# Altium schematic sheet Rail_4.SchDoc: Half Bridge 4
size A4; DocumentNumber: 6; Revision: 1.1; SheetNumber: 6; SheetTotal: 6
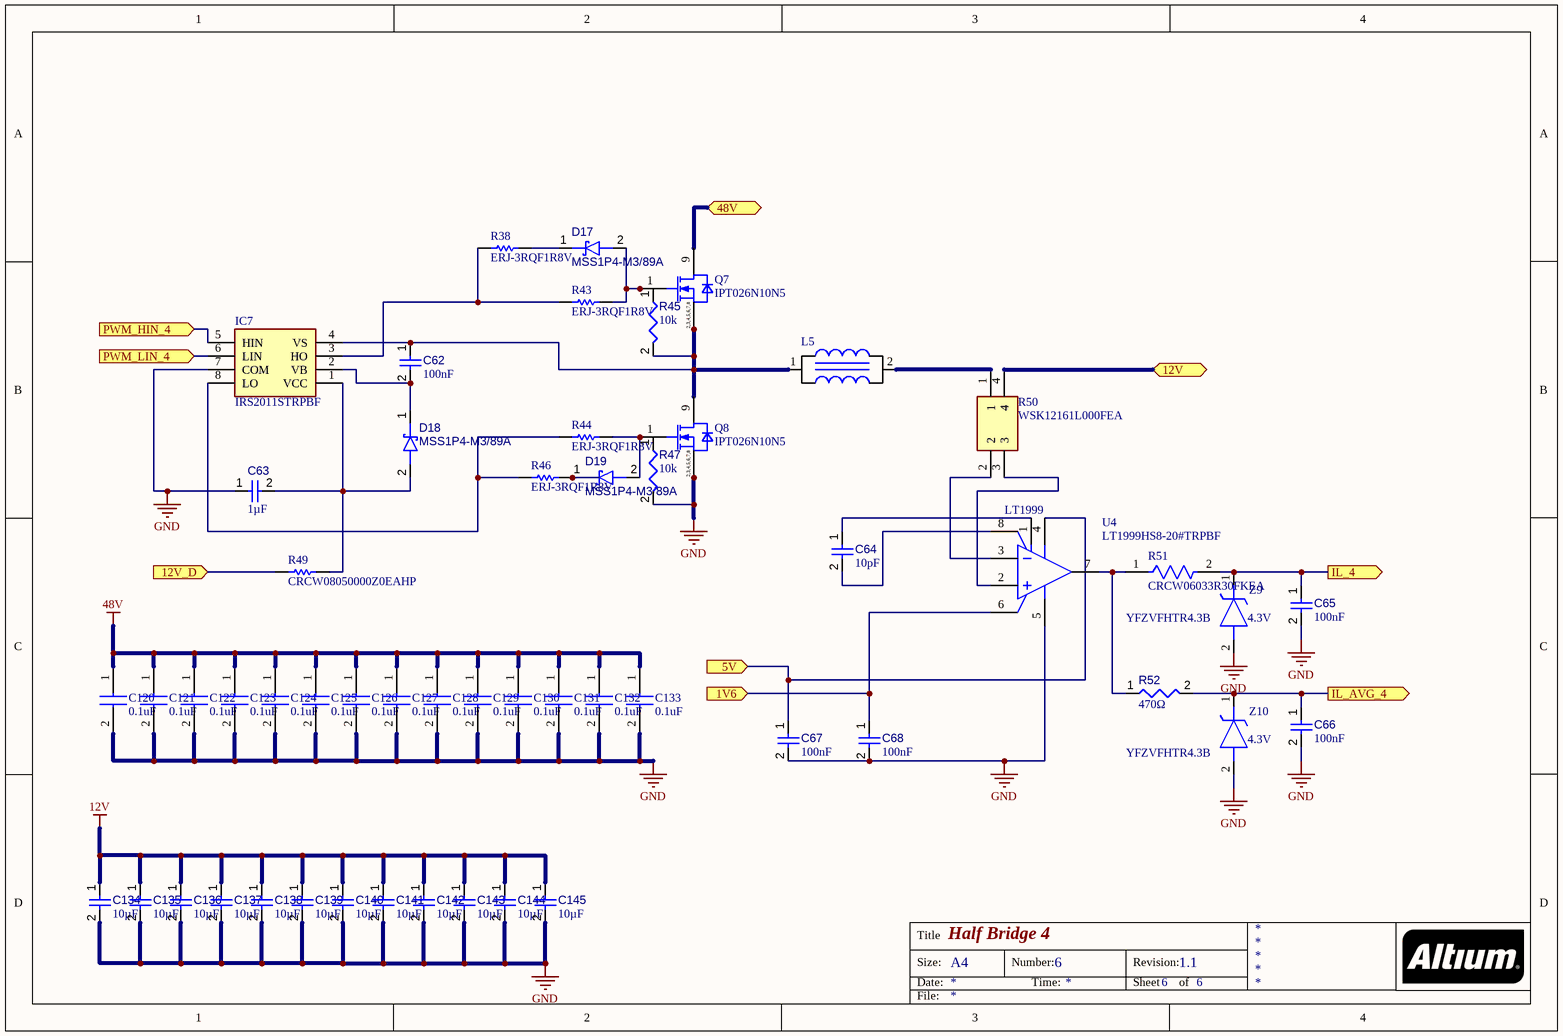
[diagram p0: Rail_4.SchDoc]

## Parts
C62  value 100nF  [CAPC1608X90X40ML10T20]  (hidden comment: Capacitor 100 nF +/-10% 50 V 0603)
C63  value 1µF  [CAPC0603(1608)100_L]  (hidden comment: Capacitor 1µF +/-0.1% 25V 0603)
C64  value 10pF  [CAPC1608X87X35ML15T15]  (hidden comment: Capacitor 10 pF +/- 0.25 pF 50 V 0603)
C65  value 100nF  [CAPC1608X90X40ML10T20]  (hidden comment: Capacitor 100 nF +/-10% 50 V 0603)
C66  value 100nF  [CAPC1608X90X40ML10T20]  (hidden comment: Capacitor 100 nF +/-10% 50 V 0603)
C67  value 100nF  [CAPC1608X90X40ML10T20]  (hidden comment: Capacitor 100 nF +/-10% 50 V 0603)
C68  value 100nF  [CAPC1608X90X40ML10T20]  (hidden comment: Capacitor 100 nF +/-10% 50 V 0603)
C120  0.1uF  [CAPC1608X90N]
C121  0.1uF  [CAPC1608X90N]
C122  0.1uF  [CAPC1608X90N]
C123  0.1uF  [CAPC1608X90N]
C124  0.1uF  [CAPC1608X90N]
C125  0.1uF  [CAPC1608X90N]
C126  0.1uF  [CAPC1608X90N]
C127  0.1uF  [CAPC1608X90N]
C128  0.1uF  [CAPC1608X90N]
C129  0.1uF  [CAPC1608X90N]
C130  0.1uF  [CAPC1608X90N]
C131  0.1uF  [CAPC1608X90N]
C132  0.1uF  [CAPC1608X90N]
C133  0.1uF  [CAPC1608X90N]
C134  value 10µF  [CAPC0805(2012)145_L]  (hidden comment: Capacitor 10µF +/-20% 25V 0805)
C135  value 10µF  [CAPC0805(2012)145_L]  (hidden comment: Capacitor 10µF +/-20% 25V 0805)
C136  value 10µF  [CAPC0805(2012)145_L]  (hidden comment: Capacitor 10µF +/-20% 25V 0805)
C137  value 10µF  [CAPC0805(2012)145_L]  (hidden comment: Capacitor 10µF +/-20% 25V 0805)
C138  value 10µF  [CAPC0805(2012)145_L]  (hidden comment: Capacitor 10µF +/-20% 25V 0805)
C139  value 10µF  [CAPC0805(2012)145_L]  (hidden comment: Capacitor 10µF +/-20% 25V 0805)
C140  value 10µF  [CAPC0805(2012)145_L]  (hidden comment: Capacitor 10µF +/-20% 25V 0805)
C141  value 10µF  [CAPC0805(2012)145_L]  (hidden comment: Capacitor 10µF +/-20% 25V 0805)
C142  value 10µF  [CAPC0805(2012)145_L]  (hidden comment: Capacitor 10µF +/-20% 25V 0805)
C143  value 10µF  [CAPC0805(2012)145_L]  (hidden comment: Capacitor 10µF +/-20% 25V 0805)
C144  value 10µF  [CAPC0805(2012)145_L]  (hidden comment: Capacitor 10µF +/-20% 25V 0805)
C145  value 10µF  [CAPC0805(2012)145_L]  (hidden comment: Capacitor 10µF +/-20% 25V 0805)
D17  MSS1P4-M3/89A  [MicroSMP (DO-219AD)]
D18  MSS1P4-M3/89A  [MicroSMP (DO-219AD)]
D19  MSS1P4-M3/89A  [MicroSMP (DO-219AD)]
IC7  IRS2011STRPBF  [SOIC127P600X175-8N-12-V]
L5  Inductor (Ansys)  [Inductor-Footprint-1]  (value not drawn)
Q7  IPT026N10N5  [INF-PG-HSOF-8-1-0-V]
Q8  IPT026N10N5  [INF-PG-HSOF-8-1-0-V]
R38  ERJ-3RQF1R8V  [RESC1608X55X30LL15T15]
R43  ERJ-3RQF1R8V  [RESC1608X55X30LL15T15]
R44  ERJ-3RQF1R8V  [RESC1608X55X30LL15T15]
R45  value 10k  [RESC1608X55X25ML10T15]  (hidden comment: Resistor 10k +/-1% 0603 100 mW)
R46  ERJ-3RQF1R8V  [RESC1608X55X30LL15T15]
R47  value 10k  [RESC1608X55X25ML10T15]  (hidden comment: Resistor 10k +/-1% 0603 100 mW)
R49  CRCW08050000Z0EAHP  [RESC2013X50X30ML20T20]
R50  WSK12161L000FEA  [WSK12161L000FEA]
R51  CRCW06033R30FKEA  [FP-CRCW0603-e3-IPC_C]
R52  value 470Ω  [RESC0805(2012)_L]  (hidden comment: 470R5J)
U4  LT1999HS8-20#TRPBF  [LT-S8-8_L]
Z9  YFZVFHTR4.3B  [YFZVFHTR43B]
Z10  YFZVFHTR4.3B  [YFZVFHTR43B]

## Ports
1V6 (in), 5V (in), 12V (bidir), 12V_D (in), 48V (bidir), IL_4 (out), IL_AVG_4 (out), PWM_HIN_4 (in), PWM_LIN_4 (in)

## Nets
12V: C134.1 C135.1 C136.1 C137.1 C138.1 C139.1 C140.1 C141.1 C142.1 C143.1 C144.1 C145.1
48V: C120.1 C121.1 C122.1 C123.1 C124.1 C125.1 C126.1 C127.1 C128.1 C129.1 C130.1 C131.1 C132.1 C133.1
GND: C63.1 C65.2 C66.2 C67.2 C68.2 C120.2 C121.2 C122.2 C123.2 C124.2 C125.2 C126.2 C127.2 C128.2 C129.2 C130.2 C131.2 C132.2 C133.2 C134.2 C135.2 C136.2 C137.2 C138.2 C139.2 C140.2 C141.2 C142.2 C143.2 C144.2 C145.2 IC7.7(COM) Q8.2(SOURCE) Q8.3(SOURCE) Q8.4(SOURCE) Q8.5(SOURCE) Q8.6(SOURCE) Q8.7(SOURCE) Q8.8(SOURCE) R47.2 U4.5(GND) Z9.2(A) Z10.2(A)
1V6: C68.1 U4.6(REF) ; port 1V6
5V: C67.1 U4.4(V+) ; port 5V
12V: R50.4 ; port 12V  [a separate net that carries the same name]
12V_D: R49.1 ; port 12V_D
48V: Q7.9(DRAIN) ; port 48V  [a separate net that carries the same name]
IL_4: C65.1 R51.2 Z9.1(K) ; port IL_4
IL_AVG_4: C66.1 R52.2 Z10.1(K) ; port IL_AVG_4
PWM_HIN_4: IC7.5(HIN) ; port PWM_HIN_4
PWM_LIN_4: IC7.6(LIN) ; port PWM_LIN_4
NetC62_1: C62.1 IC7.4(VS) L5.1 Q7.2(SOURCE) Q7.3(SOURCE) Q7.4(SOURCE) Q7.5(SOURCE) Q7.6(SOURCE) Q7.7(SOURCE) Q7.8(SOURCE) Q8.9(DRAIN) R45.2
NetC62_2: C62.2 D18.1(K) IC7.2(VB)
NetC63_2: C63.2 D18.2(A) IC7.1(VCC) R49.2
NetC64_1: C64.1 U4.1(V+)
NetC64_2: C64.2 U4.8(~{SHDN})
NetD17_1: D17.1(K) R38.2
NetD17_2: D17.2(A) Q7.1(GATE) R43.2 R45.1
NetD19_1: D19.1(K) R46.2
NetD19_2: D19.2(A) Q8.1(GATE) R44.2 R47.1
NetIC7_3: IC7.3(HO) R38.1 R43.1
NetIC7_8: IC7.8(LO) R44.1 R46.1
NetL5_2: L5.2 R50.1
NetR50_2: R50.2 U4.3(-IN)
NetR50_3: R50.3 U4.2(+IN)
NetR51_1: R51.1 R52.1 U4.7(OUT)

## Notes on the sheet
- (near U4) LT1999
- (near Z9) 4.3V
- (near Z10) 4.3V
- Title
- Size:
- Date:
- A4
- Number:
- Time:
- Revision:
- Sheet
- of
- File:
- (in symbol IPT026N10N5) 2,3,4,5,6,7,8

## Library data of the parts
C62 C65-C68 = CMP-001-00017-4: Chip Capacitor, 100 nF, +/- 10%, 50 V, 0603 (1608 Metric); Capacitor Type: Ceramic; Voltage Rating: 50V; RoHS Compliant: True; Max Operating Temperature: 125°C; Pins: 2; Mounting Technology: SM; Min Operating Temperature: -55°C; Tolerance: 10%; Case/Package: 0603
C63 = CMP-001-00055-2: Chip Capacitor, 1µF +/-0.1%, 25V, 0603, Thickness 1 mm; Tolerance: 20%; Max Operating Temperature: 85°C; Voltage Rating: 25V; Min Operating Temperature: -55°C; Case/Package: 0805; Mounting Technology: SMT; Pins: 2
C64 = CMP-001-00012-4: Chip Capacitor, 10 pF, +/- 0.25 pF, 50 V, 0603 (1608 Metric); Tolerance: 0.25%; Capacitor Type: Ceramic; Voltage Rating: 50V; Min Operating Temperature: -55°C; Mounting Technology: SM; RoHS Compliant: True; Case/Package: 0603; Pins: 2; Max Operating Temperature: 125°C
C120-C133 = 06031C104K4T2A: Capacitor; Manufacturer_Name: AVX; Datasheet Link: https://componentsearchengine.com/Datasheets/1/06031A100FAT2A.pdf; Height: 0.9mm; Manufacturer_Part_Number: 06031C104K4T2A; Mouser Part Number: 581-06031C104K4T2A; Mouser Price/Stock: https://www.mouser.co.uk/ProductDetail/AVX/06031C104K4T2A?qs=7MVldsJ5UaycASOsZ6%2FbJQ%3D%3D
C134-C145 = CMP-001-00079-2: Chip Capacitor, 10µF +/-20%, 25V, 0805, Thickness 1.45 mm; Tolerance: 10%; Pins: 2; Max Operating Temperature: 85°C; Mounting Technology: SMT; Case/Package: 0603; Voltage Rating: 25V; Min Operating Temperature: -55°C
D17-D19 = CMP-004-00024-2: Schottky Diodes & Rectifiers 1.0 Amp 40 Volt; Max Surge Current: 25A; Forward Voltage: 460mV; Pins: 2; Min Operating Temperature: -55°C; Max Operating Temperature: 150°C; Mounting Technology: SMT
IC7 = IRS2011STRPBF: Integrated Circuit; Manufacturer_Name: Infineon; Datasheet Link: https://componentsearchengine.com/Datasheets/1/IRS2011STRPBF.pdf; Height: 1.75mm; Manufacturer_Part_Number: IRS2011STRPBF; Arrow Part Number: IRS2011STRPBF; Arrow Price/Stock: https://www.arrow.com/en/products/irs2011strpbf/infineon-technologies-ag; Mouser Part Number: 942-IRS2011STRPBF; Mouser Price/Stock: https://www.mouser.co.uk/ProductDetail/Infineon-IR/IRS2011STRPBF?qs=9%252BKlkBgLFf3Y4ge8A0TwYQ%3D%3D
L5 = CMP-006-00021-3: Ansys 3D Model
Q7 Q8 = IPT026N10N5: Insulated-Gate Field-Effect Transistor (IGFET), N-Channel, Enhancement, Body Diode, Pin 1 Gate, 2-8 Source, 9 Drain, 9 Pins; Manufacturer: Infineon Technologies; PackageReference: PG-HSOF-8-1; ManufacturerPartNumber: IPT026N10N5
R38 R43 R44 R46 = CMP-2000-00844-1: Manufacturer: Panasonic; Part Number: ERJ-3RQF1R8V
R45 R47 = CMP-009-00017-4: Chip Resistor, 10 KOhm, +/- 1%, 01 W, -55 to 155 degC, 0603 (1608 Metric); Voltage Rating: 50V; Power: 100mW; Min Operating Temperature: -55°C; Tolerance: 1%; Case/Package: 0603; Pins: 2; Max Operating Temperature: 155°C; RoHS Compliant: True; Mounting Technology: SM
R49 = CMP-2001-04185-1: Manufacturer: Vishay Dale; Part Number: CRCW08050000Z0EAHP
R50 = WSK12161L000FEA: Resistor; Manufacturer_Name: Vishay; Datasheet Link: http://www.vishay.com/docs/30189/wsk1216.pdf; Height: 1.9mm; Manufacturer_Part_Number: WSK12161L000FEA; Arrow Part Number: WSK12161L000FEA; Arrow Price/Stock: https://www.arrow.com/en/products/wsk12161l000fea/vishay; Mouser Part Number: 71-WSK12161L000FEA; Mouser Price/Stock: https://www.mouser.co.uk/ProductDetail/Vishay-Dale/WSK12161L000FEA?qs=jj7GbYRQuOayzWPPW7c8og%3D%3D
R51 = CMP-1012-00228-3: RES Thick Film, 3.3Ω, 1%, 0.1W, 100ppm/°C, 0603; Resistance: 3.3R; Max Power Dissipation: 100mW; Voltage Rating: 75V; Case Code (Imperial): 0603; Width: 0.85mm; Number of Terminations: 2; REACH SVHC: No SVHC; Case/Package: 0603; Package Quantity: 10; Radiation Hardening: No; Min Operating Temperature: -55°C; Max Operating Temperature: 155°C; Composition: Thick Film; Termination: SMD/SMT; Tolerance: 1%; Military Standard: Not; Weight: 7.1E-05oz; Contact Plating: Tin; Packaging: Tape and Reel; Power Rating: 100mW; Height: 0.02inch; Length: 1.55mm; Voltage Rating (DC): 75V; Temperature Coefficient: 100ppm/°C; Case Code (Metric): 1608; Depth: 0.85mm; Lead Free: Lead Free; Features: Automotive AEC-Q200
R52 = CMP-009-00102-1: 470R 0.125W 5% 0805 (2012 Metric)  SMD; Power: 0.125W; Tolerance: 5%; Mounting Technology: SMT; Case/Package: 0603; Pins: 2
U4 = CMP-0359-03344-2: Single Channel, High Voltage, Bidirectional Current Sense Amplifier, 2 MHz Typical GBW, 3 V/us Typical SR, 4.5 to 5.5 V, 8-Pin SOIC (S8-8), High Temperature / Automotive, Pb-Free, Reel; Linear Technology Part Number: LT1999-20; Manufacturer: Linear Technology; Channels (#): 1; GBW (MHz) Typical: 2; Is (mA) Typical: 1.55; Vs Max (V): 5.5; SR (V/us) Typical: 3; Vos (mV) Typical: 0.5; Vs Min (V): 4.5; ComponentLink2Description: Datasheet; RoHS: Pb-Free; ComponentLink1URL: http://www.linear.com/; Type: CSA; DatasheetVersion: Rev. B; ComponentLink3URL: http://cds.linear.com/docs/en/packaging/05081610_G_SO8.pdf; ComponentLink1Description: Manufacturer URL; PackageReference: LT-S8-8; PackageVersion: Rev G; PartNumber: LT1999HS8-20#TRPBF; RevisionNote: URLs updated; Packing: Reel; PackageDescription: 8-Pin Plastic Small Outline, Body 4.9 x 3.9 mm, Pitch 1.27 mm; ComponentLink3Description: Package Specification; Mounting Technology: Surface Mount; ComponentLink2URL: http://cds.linear.com/docs/en/datasheet/1999fb.pdf
Z9 Z10 = YFZVFHTR4.3B: Zener Diode; Manufacturer_Name: ROHM Semiconductor; Datasheet Link: https://componentsearchengine.com/Datasheets/2/YFZVFHTR4.3B.pdf; Height: 0.8mm; Manufacturer_Part_Number: YFZVFHTR4.3B; Mouser Part Number: 755-YFZVFHTR4.3B; Mouser Price/Stock: https://www.mouser.co.uk/ProductDetail/ROHM-Semiconductor/YFZVFHTR43B?qs=4v%252BiZTmLVHGVnMzHBrJLew%3D%3D